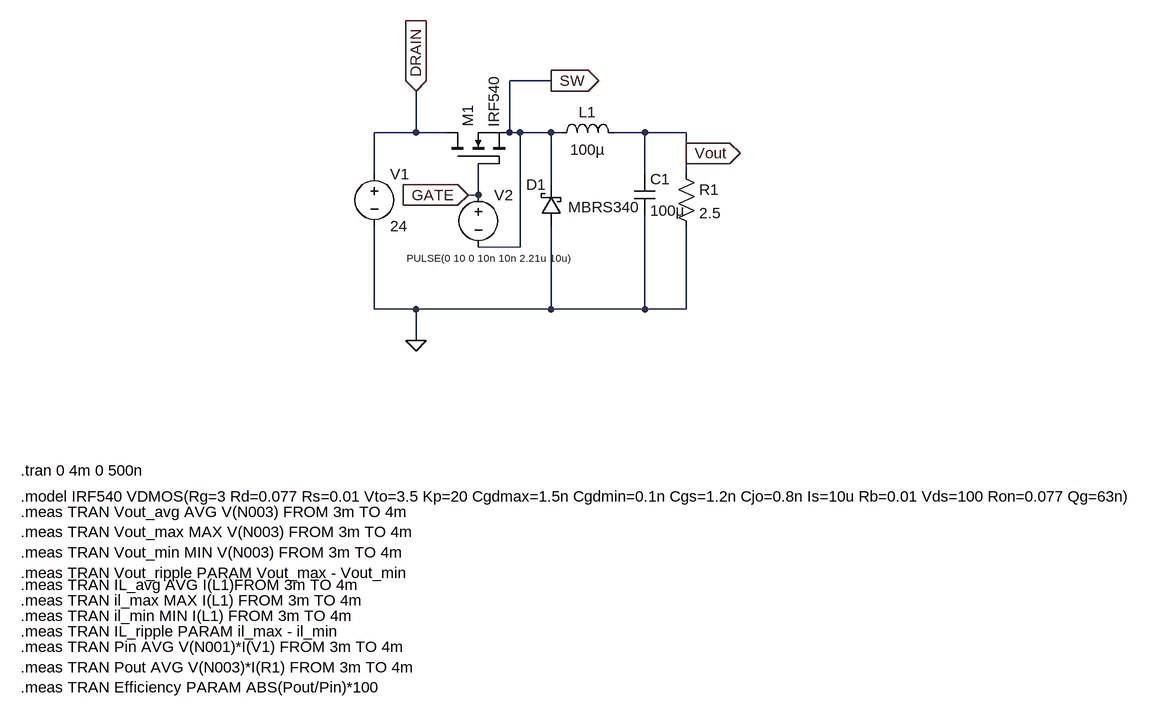
[diagram p0: schematic buck_24V_5V_openloop.asc]
buck_24V_5V_openloop.asc, the LTspice schematic file:
Version 4.1
SHEET 1 1880 1128
WIRE 272 -48 208 -48
WIRE 64 32 64 -32
WIRE 64 32 0 32
WIRE 112 32 64 32
WIRE 208 32 208 -48
WIRE 224 32 208 32
WIRE 272 32 224 32
WIRE 288 32 272 32
WIRE 416 32 368 32
WIRE 480 32 416 32
WIRE 480 64 480 32
WIRE 192 80 160 80
WIRE 0 96 0 32
WIRE 416 96 416 32
WIRE 480 96 480 64
WIRE 272 112 272 32
WIRE 160 128 160 80
WIRE 160 128 144 128
WIRE 224 208 224 32
WIRE 224 208 160 208
WIRE 0 304 0 176
WIRE 64 304 0 304
WIRE 272 304 272 176
WIRE 272 304 64 304
WIRE 416 304 416 160
WIRE 416 304 272 304
WIRE 480 304 480 176
WIRE 480 304 416 304
WIRE 64 352 64 304
FLAG 64 352 0
FLAG 480 64 Vout
IOPIN 480 64 Out
FLAG 272 -48 SW
IOPIN 272 -48 Out
FLAG 144 128 GATE
IOPIN 144 128 In
FLAG 64 -32 DRAIN
IOPIN 64 -32 In
SYMBOL voltage 0 80 R0
WINDOW 123 0 0 Left 0
WINDOW 39 0 0 Left 0
SYMATTR InstName V1
SYMATTR Value 24
SYMBOL voltage 160 112 R0
WINDOW 3 -110 113 Left 1
WINDOW 123 0 0 Left 0
WINDOW 39 0 0 Left 0
SYMATTR Value PULSE(0 10 0 10n 10n 2.21u 10u)
SYMATTR InstName V2
SYMBOL cap 400 96 R0
SYMATTR InstName C1
SYMATTR Value 100µ
SYMBOL schottky 288 176 R180
WINDOW 0 24 64 Left 2
WINDOW 3 -120 29 Left 2
SYMATTR InstName D1
SYMATTR Value MBRS340
SYMBOL ind 272 48 R270
WINDOW 0 32 56 VTop 2
WINDOW 3 5 56 VBottom 2
SYMATTR InstName L1
SYMATTR Value 100µ
SYMBOL res 464 80 R0
SYMATTR InstName R1
SYMATTR Value 2.5
SYMBOL nmos 112 80 R270
SYMATTR InstName M1
SYMATTR Value IRF540
TEXT -544 552 Left 2 !.tran 0 4m 0 500n
TEXT -544 592 Left 2 !.model IRF540 VDMOS(Rg=3 Rd=0.077 Rs=0.01 Vto=3.5 Kp=20 Cgdmax=1.5n Cgdmin=0.1n Cgs=1.2n Cjo=0.8n Is=10u Rb=0.01 Vds=100 Ron=0.077 Qg=63n)
TEXT -544 616 Left 2 !.meas TRAN Vout_avg AVG V(N003) FROM 3m TO 4m\n.meas TRAN Vout_max MAX V(N003) FROM 3m TO 4m\n.meas TRAN Vout_min MIN V(N003) FROM 3m TO 4m\n.meas TRAN Vout_ripple PARAM Vout_max - Vout_min
TEXT -544 728 Left 2 !.meas TRAN IL_avg AVG I(L1)FROM 3m TO 4m
TEXT -544 752 Left 2 !.meas TRAN il_max MAX I(L1) FROM 3m TO 4m
TEXT -544 776 Left 2 !.meas TRAN il_min MIN I(L1) FROM 3m TO 4m
TEXT -544 800 Left 2 !.meas TRAN IL_ripple PARAM il_max - il_min
TEXT -544 824 Left 2 !.meas TRAN Pin AVG V(N001)*I(V1) FROM 3m TO 4m\n.meas TRAN Pout AVG V(N003)*I(R1) FROM 3m TO 4m\n.meas TRAN Efficiency PARAM ABS(Pout/Pin)*100

The netlist it stands for:
* buck_24V_5V_openloop.asc
V1 DRAIN 0 24
V2 GATE SW PULSE(0 10 0 10n 10n 2.21u 10u)
C1 Vout 0 100µ
D1 0 SW MBRS340
L1 SW Vout 100µ
R1 Vout 0 2.5
M1 DRAIN GATE SW SW IRF540
.model D D
.lib standard.dio
.model NMOS NMOS
.model PMOS PMOS
.lib standard.mos
.tran 0 4m 0 500n
.model IRF540 VDMOS(Rg=3 Rd=0.077 Rs=0.01 Vto=3.5 Kp=20 Cgdmax=1.5n Cgdmin=0.1n Cgs=1.2n Cjo=0.8n Is=10u Rb=0.01 Vds=100 Ron=0.077 Qg=63n)
.meas TRAN Vout_avg AVG V(N003) FROM 3m TO 4m
.meas TRAN Vout_max MAX V(N003) FROM 3m TO 4m
.meas TRAN Vout_min MIN V(N003) FROM 3m TO 4m
.meas TRAN Vout_ripple PARAM Vout_max - Vout_min
.meas TRAN IL_avg AVG I(L1)FROM 3m TO 4m
.meas TRAN il_max MAX I(L1) FROM 3m TO 4m
.meas TRAN il_min MIN I(L1) FROM 3m TO 4m
.meas TRAN IL_ripple PARAM il_max - il_min
.meas TRAN Pin AVG V(N001)*I(V1) FROM 3m TO 4m
.meas TRAN Pout AVG V(N003)*I(R1) FROM 3m TO 4m
.meas TRAN Efficiency PARAM ABS(Pout/Pin)*100
.backanno
.end